# EAGLE design Low-Frequency LC Oscillator (EAGLE 7.7.0)
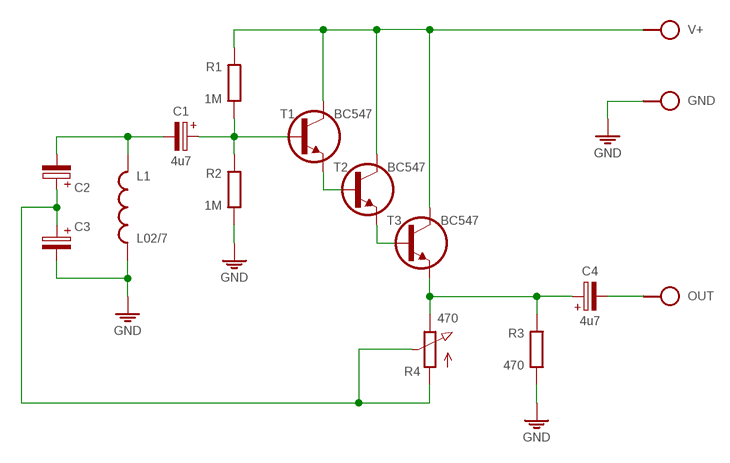
[diagram p0: schematic, sheet 1]

## Parts
C1  4u7  CPOLE2,5-3  [E2,5-3]
C2  CPOLE2.5-5  [E2,5-5]
C3  CPOLE2.5-5  [E2,5-5]
C4  4u7  CPOLE2,5-3  [E2,5-3]
GND  SPAD  [SPAD]
L1  L02/7  [L-02/7V]
OUT  SPAD  [SPAD]
R1  1M  R0204/10  [0204/10]
R2  1M  R0204/10  [0204/10]
R3  470  R0204/10  [0204/10]
R4  470  POT  [POT]
T1  BC547  BC547CBE  [TO92-CBE]
T2  BC547  BC547CBE  [TO92-CBE]
T3  BC547  BC547CBE  [TO92-CBE]
V+  SPAD  [SPAD]

## Nets
GND: C3.- GND.1 L1.2 R2.1 R3.1
N$1: R1.2 T1.C T2.C T3.C V+.1
N$2: C4.- OUT.1
N$5: C4.+ R3.2 R4.3(E) T3.E
N$6: T1.E T2.B
N$7: T2.E T3.B
N$8: C1.- C2.- L1.1
N$9: C1.+ R1.1 R2.2 T1.B
N$10: C2.+ C3.+ R4.1(A) R4.2(S)

## Library data of the parts
C1-C4 = c:CPOL: POLARIZED CAPACITOR, European symbol
GND OUT V+ = pad:SPAD
L1 = r:L
R1-R3 = r:R: RESISTOR, European symbol
R4 = r:POT
T1-T3 = t:BC547

## Board
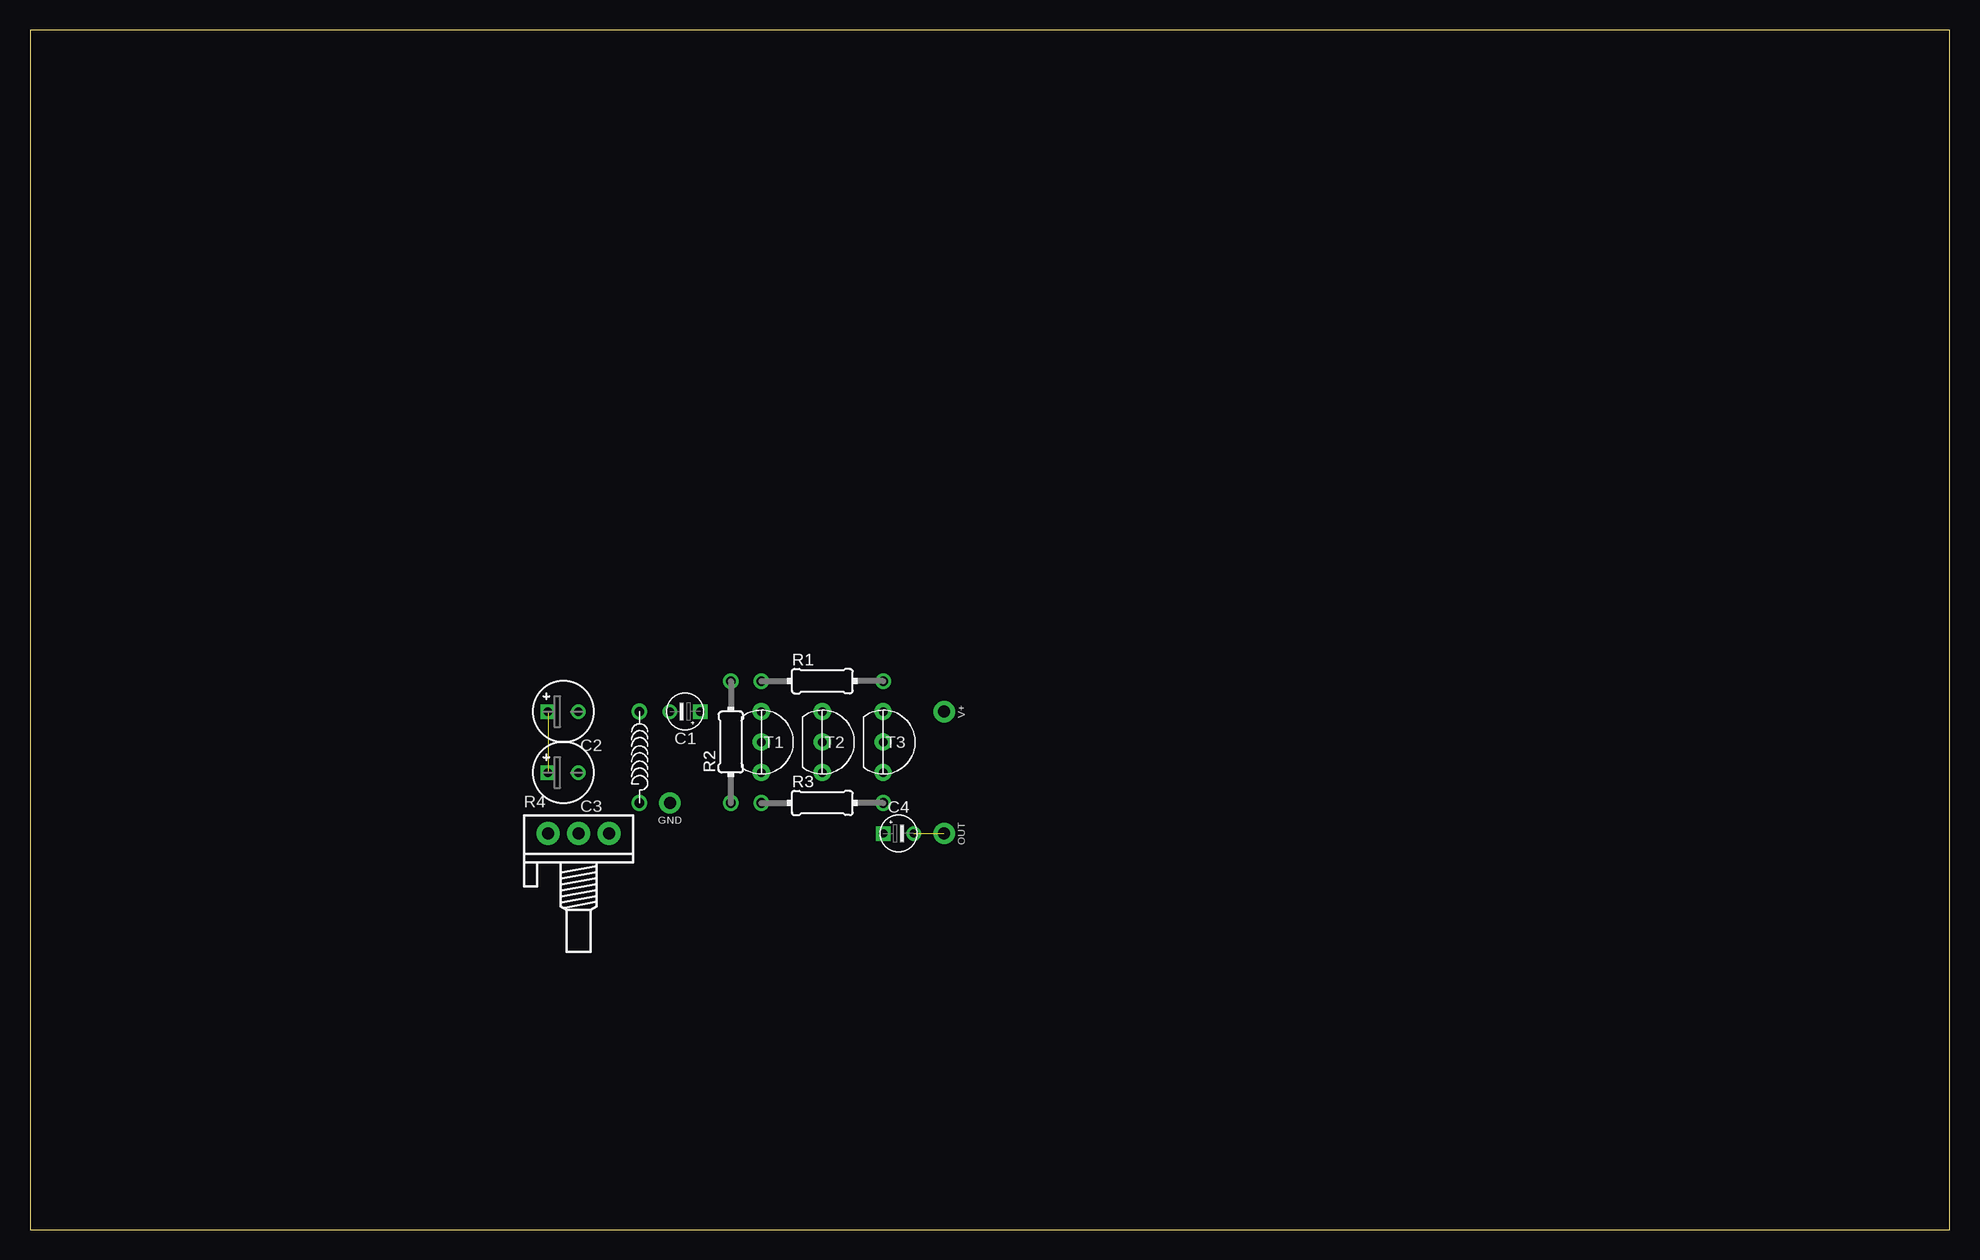
[diagram p1: board, top side]
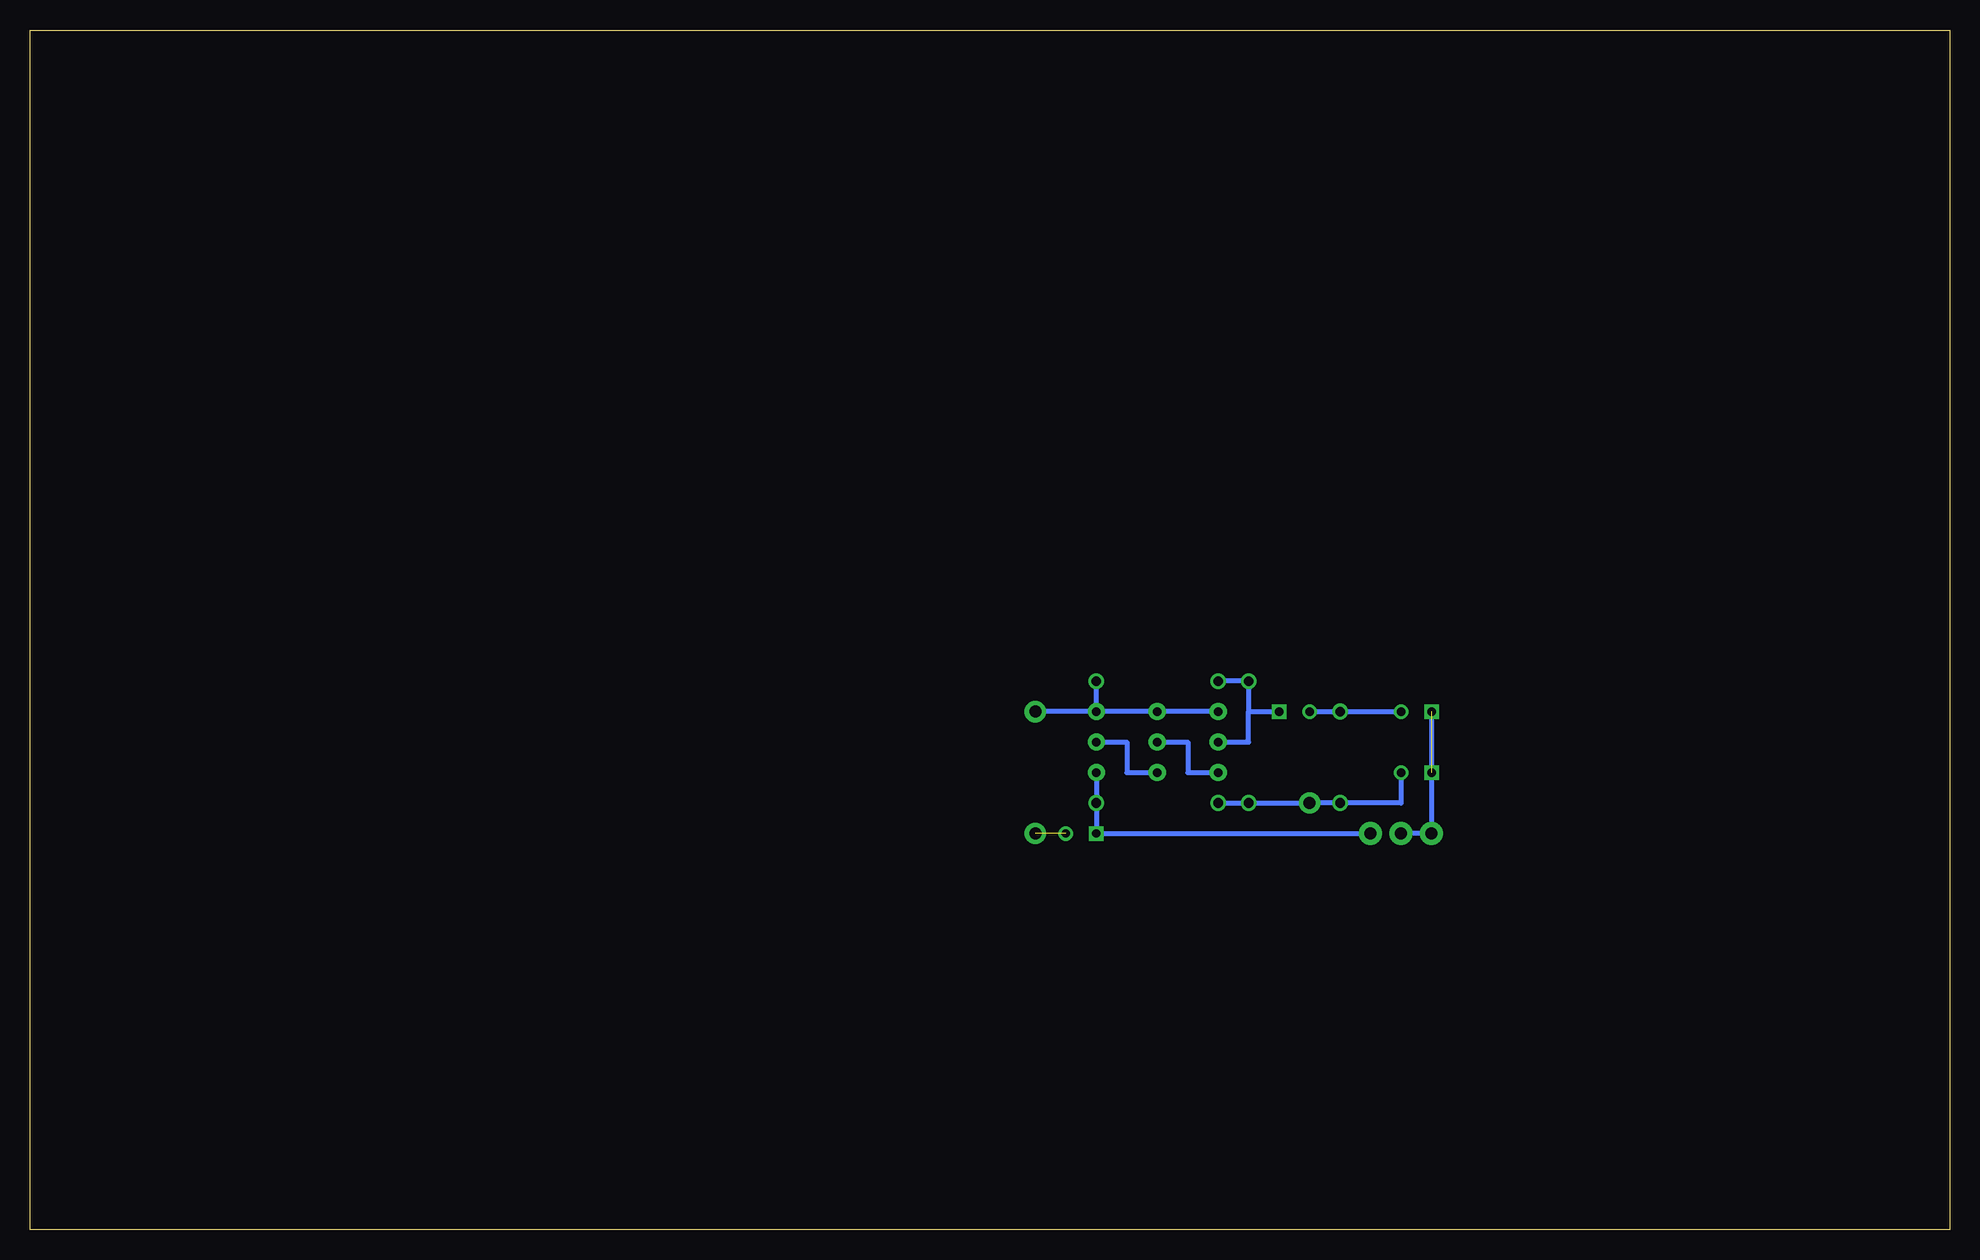
[diagram p2: board, bottom side, seen from below]

Size 160 x 100 mm. Coordinates in mm from the lower left corner, seen from the top.
Outline: 0,0 160,0 160,100 0,100 0,0
Copper layers (1*16): Top 0.035mm / dielectric 1.5mm / Bottom 0.035mm
Design rules "default": minimum track width 10mil, minimum drill 24mil, track to track 8mil, track to pad 8mil, pad to pad 8mil, via to via 8mil, smd to smd 8mil, copper to edge 40mil, drill to drill 8mil, minimum pad ring 10mil, minimum via ring 8mil, stop-mask expansion 4mil, vias tented up to drill 0mil, thermal gap 10mil

### Footprints (pad centres in the part's own frame; a part is rotated, then mirrored left to right if it is on the bottom)
E2,5-3 = drill 0.7 square: + 0,1.27 | drill 0.7: - 0,-1.27
E2,5-5 = drill 0.7 square: + 1.27,0 | drill 0.7: - -1.27,0
SPAD = drill 1 pad 1.778: 1 0,0
L-02/7V = drill 0.8: 1 0,3.81; 2 0,-3.81
0204/10 = drill 0.8: 1 -5.08,0; 2 5.08,0
POT = drill 1 pad 1.93: 1 -2.54,0; 2 0,0; 3 2.54,0
TO92-CBE = drill 0.7 pad 1.422: B 0,0; C 0,2.54; E 0,-2.54

### Placement (x,y rotation side)
C1  54.61,43.18 270 top
C2  44.45,43.18 180 top
C3  44.45,38.1 180 top
C4  72.39,33.02 90 top
GND  53.34,35.56 90 top
L1  50.8,39.37 0 top
OUT  76.2,33.02 180 top
R1  66.04,45.72 0 top
R2  58.42,40.64 90 top
R3  66.04,35.56 0 top
R4  45.72,33.02 0 top
T1  60.96,40.64 0 top
T2  66.04,40.64 0 top
T3  71.12,40.64 0 top
V+  76.2,43.18 180 top

### Tracks (layer width: path | path; a pad name or v marks a point on that pad's centre or on a via)
GND
  Bottom 0.406: C3.- 45.72,35.56 L1.2 GND.1 R2.1 R3.1
N$1
  Bottom 0.406: T3.C V+.1 | T3.C T2.C T1.C | T3.C R1.2
N$2  (1 unrouted)
N$5
  Bottom 0.406: T3.E R3.2 C4.+ R4.3
N$6
  Bottom 0.406: T2.B 63.5,40.64 63.5,38.1 T1.E
N$7
  Bottom 0.406: T3.B 68.58,40.64 68.58,38.1 T2.E
N$8
  Bottom 0.406: C1.- L1.1 C2.-
N$9
  Bottom 0.406: T1.B 58.42,40.64 58.42,43.18 | R1.1 R2.2 58.42,43.18 | 58.42,43.18 C1.+
N$10  (1 unrouted)
  Bottom 0.406: C2.+ R4.1 R4.2